# EAGLE design Lighthouse Tracker (EAGLE 9.6.2)
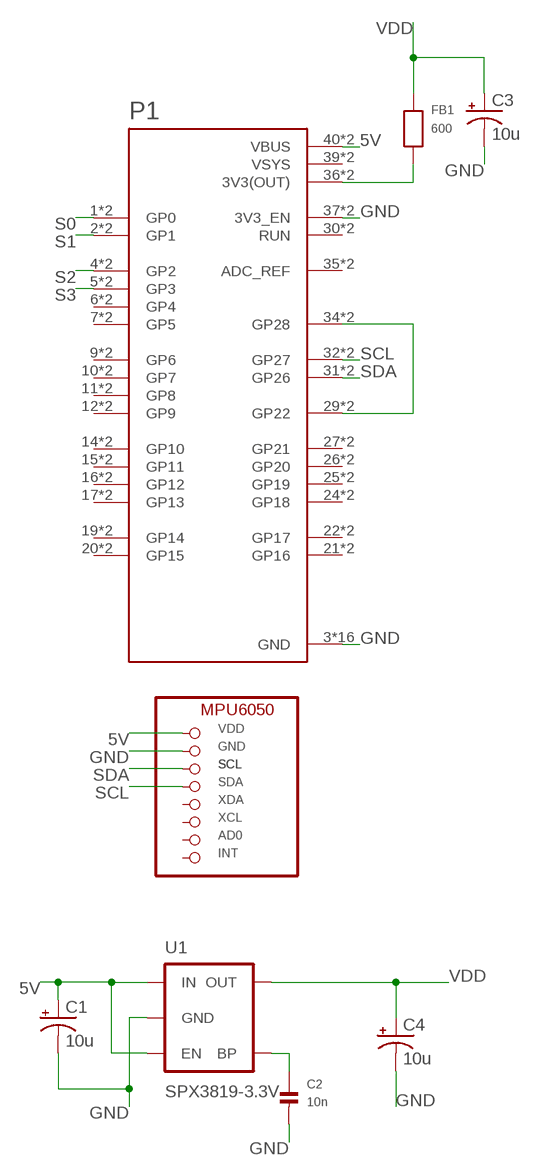
[diagram p0: schematic, sheet 1, part 1 of 2]
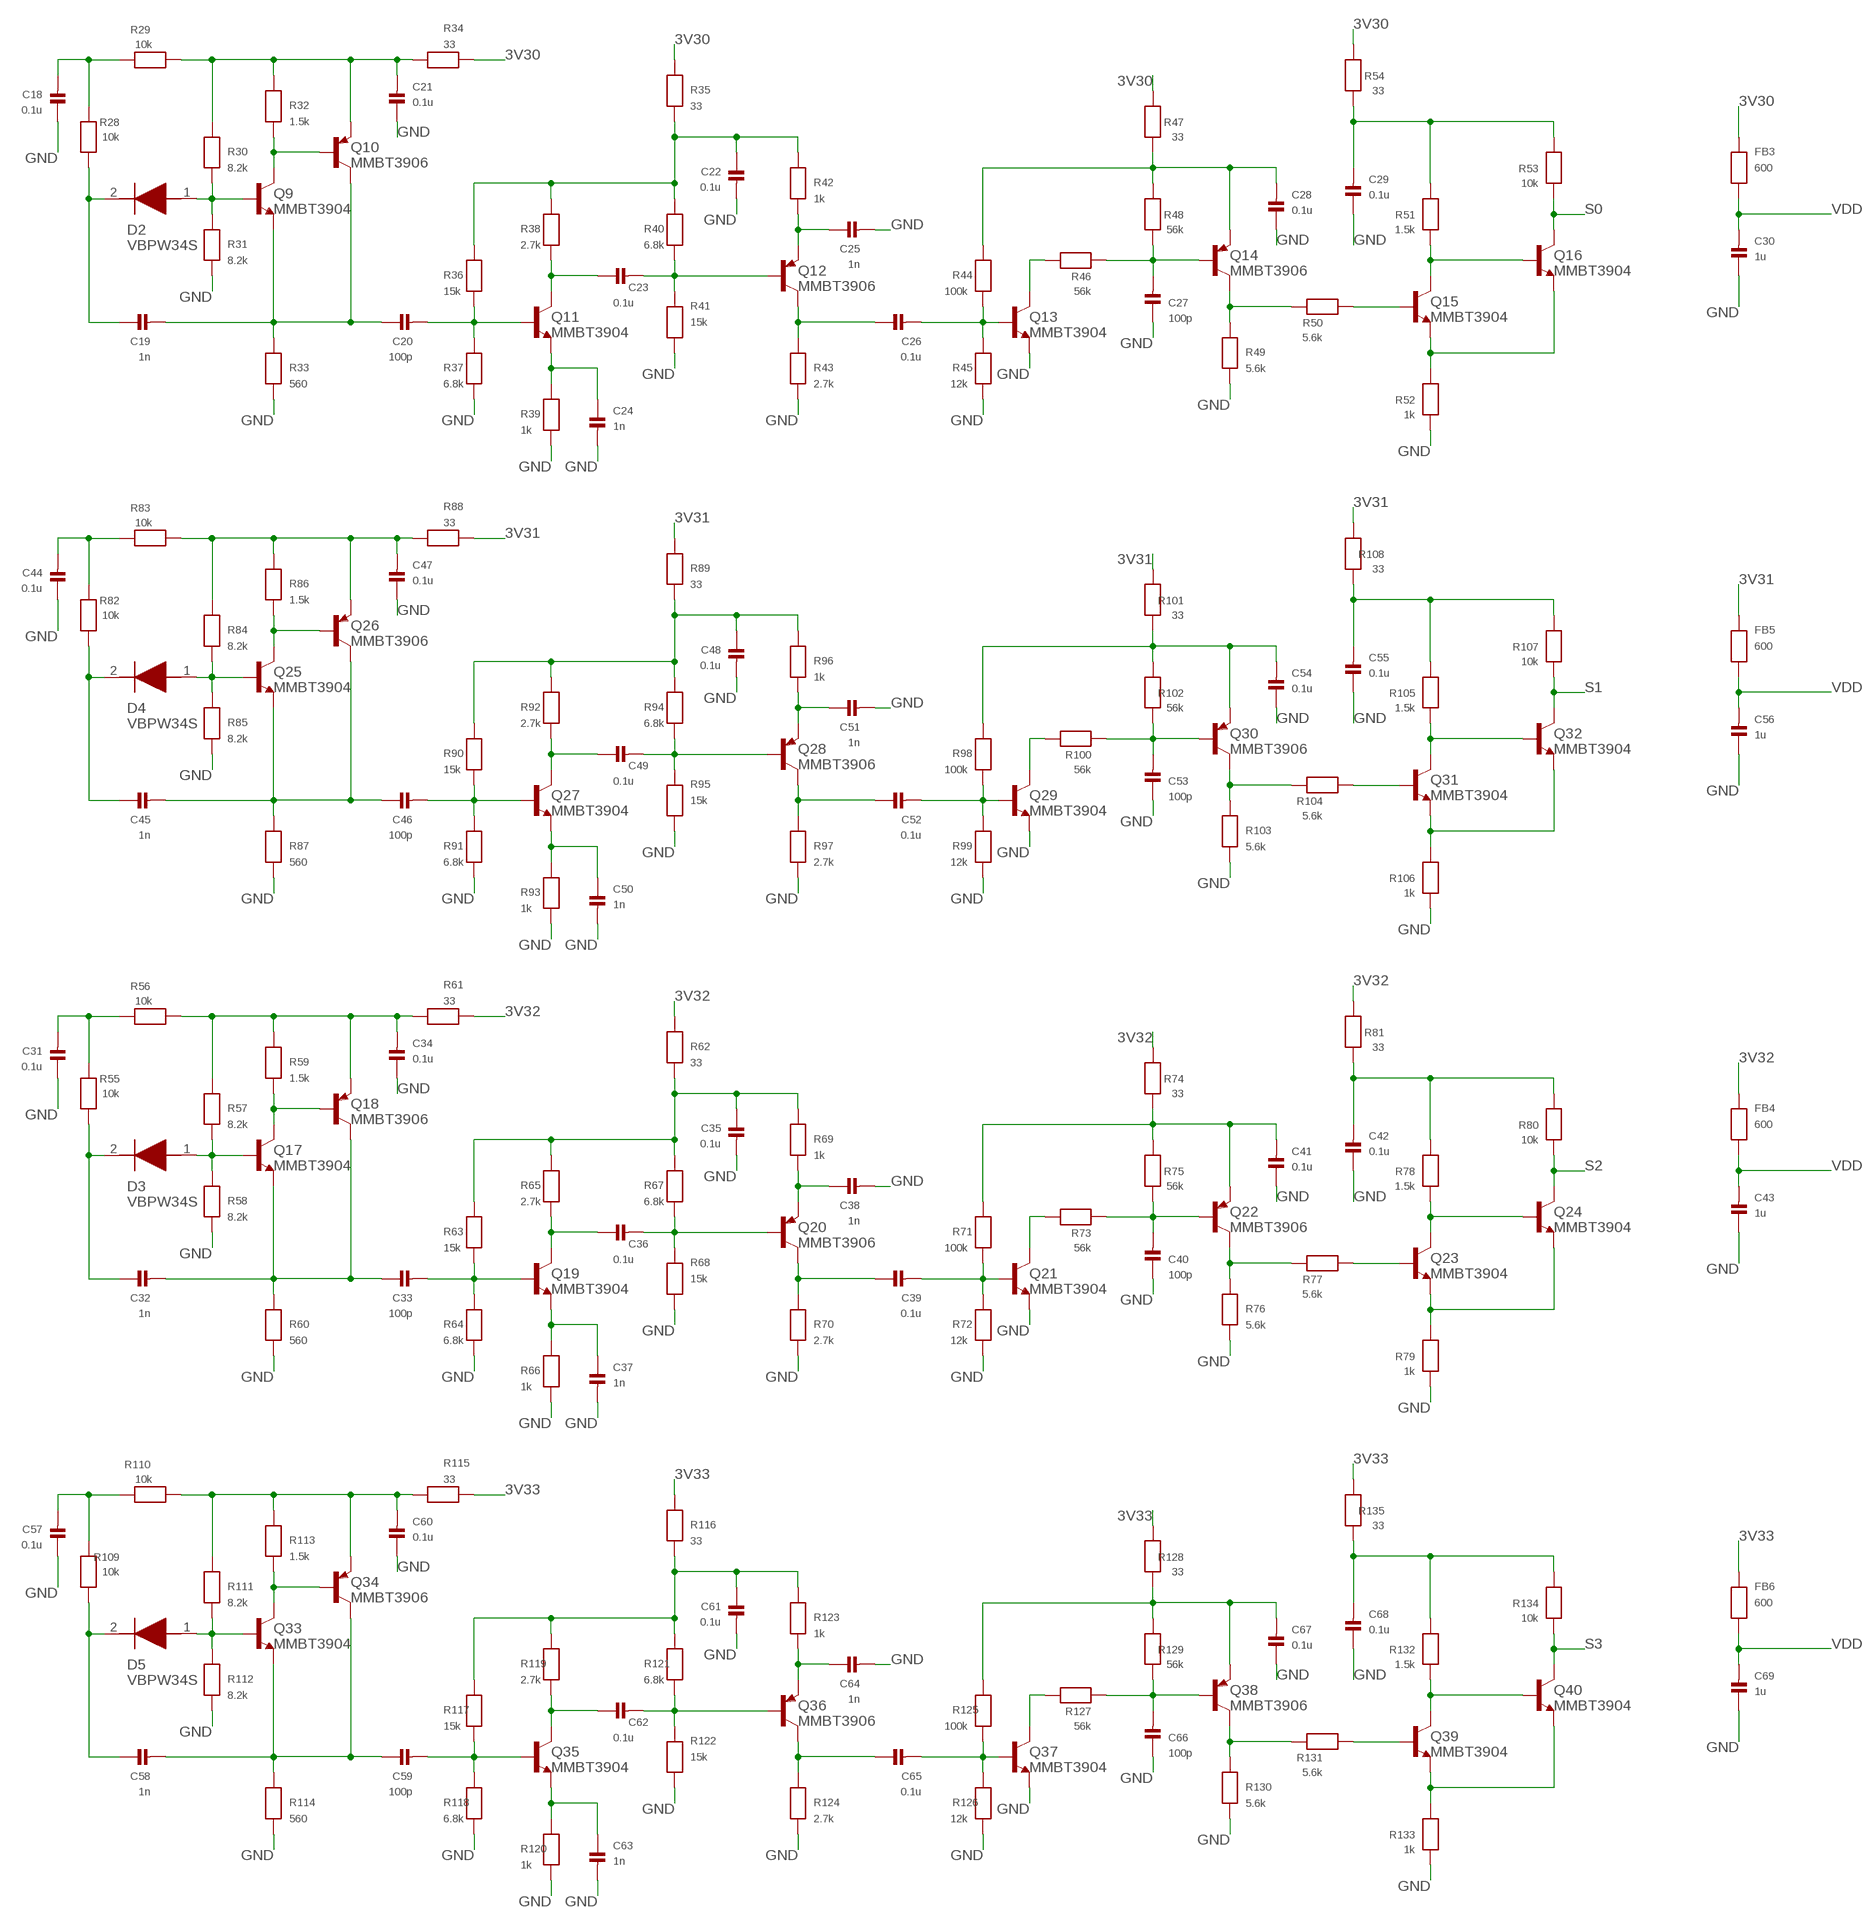
[diagram p1: schematic, sheet 1, part 2 of 2]

## Parts
B1  MPU6050BREAKOUT  [MPU6050]
C1  10u  CPOL-USA/3216-18R  [A/3216-18R]
C2  10n  CAP_CERAMIC0603  [0603]
C3  10u  CPOL-USA/3216-18R  [A/3216-18R]
C4  10u  CPOL-USA/3216-18R  [A/3216-18R]
C18  0.1u  CAP_CERAMIC_C0603  [C0603]
C19  1n  CAP_CERAMIC_C0603  [C0603]
C20  100p  CAP_CERAMIC_C0603  [C0603]
C21  0.1u  CAP_CERAMIC_C0603  [C0603]
C22  0.1u  CAP_CERAMIC_C0603  [C0603]
C23  0.1u  CAP_CERAMIC_C0603  [C0603]
C24  1n  CAP_CERAMIC_C0603  [C0603]
C25  1n  CAP_CERAMIC_C0603  [C0603]
C26  0.1u  CAP_CERAMIC_C0603  [C0603]
C27  100p  CAP_CERAMIC_C0603  [C0603]
C28  0.1u  CAP_CERAMIC_C0603  [C0603]
C29  0.1u  CAP_CERAMIC_C0603  [C0603]
C30  1u  CAP_CERAMIC_C0603  [C0603]
C31  0.1u  CAP_CERAMIC_C0603  [C0603]
C32  1n  CAP_CERAMIC_C0603  [C0603]
C33  100p  CAP_CERAMIC_C0603  [C0603]
C34  0.1u  CAP_CERAMIC_C0603  [C0603]
C35  0.1u  CAP_CERAMIC_C0603  [C0603]
C36  0.1u  CAP_CERAMIC_C0603  [C0603]
C37  1n  CAP_CERAMIC_C0603  [C0603]
C38  1n  CAP_CERAMIC_C0603  [C0603]
C39  0.1u  CAP_CERAMIC_C0603  [C0603]
C40  100p  CAP_CERAMIC_C0603  [C0603]
C41  0.1u  CAP_CERAMIC_C0603  [C0603]
C42  0.1u  CAP_CERAMIC_C0603  [C0603]
C43  1u  CAP_CERAMIC_C0603  [C0603]
C44  0.1u  CAP_CERAMIC_C0603  [C0603]
C45  1n  CAP_CERAMIC_C0603  [C0603]
C46  100p  CAP_CERAMIC_C0603  [C0603]
C47  0.1u  CAP_CERAMIC_C0603  [C0603]
C48  0.1u  CAP_CERAMIC_C0603  [C0603]
C49  0.1u  CAP_CERAMIC_C0603  [C0603]
C50  1n  CAP_CERAMIC_C0603  [C0603]
C51  1n  CAP_CERAMIC_C0603  [C0603]
C52  0.1u  CAP_CERAMIC_C0603  [C0603]
C53  100p  CAP_CERAMIC_C0603  [C0603]
C54  0.1u  CAP_CERAMIC_C0603  [C0603]
C55  0.1u  CAP_CERAMIC_C0603  [C0603]
C56  1u  CAP_CERAMIC_C0603  [C0603]
C57  0.1u  CAP_CERAMIC_C0603  [C0603]
C58  1n  CAP_CERAMIC_C0603  [C0603]
C59  100p  CAP_CERAMIC_C0603  [C0603]
C60  0.1u  CAP_CERAMIC_C0603  [C0603]
C61  0.1u  CAP_CERAMIC_C0603  [C0603]
C62  0.1u  CAP_CERAMIC_C0603  [C0603]
C63  1n  CAP_CERAMIC_C0603  [C0603]
C64  1n  CAP_CERAMIC_C0603  [C0603]
C65  0.1u  CAP_CERAMIC_C0603  [C0603]
C66  100p  CAP_CERAMIC_C0603  [C0603]
C67  0.1u  CAP_CERAMIC_C0603  [C0603]
C68  0.1u  CAP_CERAMIC_C0603  [C0603]
C69  1u  CAP_CERAMIC_C0603  [C0603]
D2  VBPW34S  [VBPW34S]
D3  VBPW34S  [VBPW34S]
D4  VBPW34S  [VBPW34S]
D5  VBPW34S  [VBPW34S]
FB1  600  RESISTOR_R0603  [R0603]
FB3  600  RESISTOR_R0603  [R0603]
FB4  600  RESISTOR_R0603  [R0603]
FB5  600  RESISTOR_R0603  [R0603]
FB6  600  RESISTOR_R0603  [R0603]
P1  RASPBERRY_PICO-NO_DEBUG  [PICO-PKG-NO_DEBUG]
Q9  MMBT3904  BC849SMD  [SOT23-BEC]
Q10  MMBT3906  MMBT3906LT1SMD  [SOT23-BEC]
Q11  MMBT3904  BC849SMD  [SOT23-BEC]
Q12  MMBT3906  MMBT3906LT1SMD  [SOT23-BEC]
Q13  MMBT3904  BC849SMD  [SOT23-BEC]
Q14  MMBT3906  MMBT3906LT1SMD  [SOT23-BEC]
Q15  MMBT3904  BC849SMD  [SOT23-BEC]
Q16  MMBT3904  BC849SMD  [SOT23-BEC]
Q17  MMBT3904  BC849SMD  [SOT23-BEC]
Q18  MMBT3906  MMBT3906LT1SMD  [SOT23-BEC]
Q19  MMBT3904  BC849SMD  [SOT23-BEC]
Q20  MMBT3906  MMBT3906LT1SMD  [SOT23-BEC]
Q21  MMBT3904  BC849SMD  [SOT23-BEC]
Q22  MMBT3906  MMBT3906LT1SMD  [SOT23-BEC]
Q23  MMBT3904  BC849SMD  [SOT23-BEC]
Q24  MMBT3904  BC849SMD  [SOT23-BEC]
Q25  MMBT3904  BC849SMD  [SOT23-BEC]
Q26  MMBT3906  MMBT3906LT1SMD  [SOT23-BEC]
Q27  MMBT3904  BC849SMD  [SOT23-BEC]
Q28  MMBT3906  MMBT3906LT1SMD  [SOT23-BEC]
Q29  MMBT3904  BC849SMD  [SOT23-BEC]
Q30  MMBT3906  MMBT3906LT1SMD  [SOT23-BEC]
Q31  MMBT3904  BC849SMD  [SOT23-BEC]
Q32  MMBT3904  BC849SMD  [SOT23-BEC]
Q33  MMBT3904  BC849SMD  [SOT23-BEC]
Q34  MMBT3906  MMBT3906LT1SMD  [SOT23-BEC]
Q35  MMBT3904  BC849SMD  [SOT23-BEC]
Q36  MMBT3906  MMBT3906LT1SMD  [SOT23-BEC]
Q37  MMBT3904  BC849SMD  [SOT23-BEC]
Q38  MMBT3906  MMBT3906LT1SMD  [SOT23-BEC]
Q39  MMBT3904  BC849SMD  [SOT23-BEC]
Q40  MMBT3904  BC849SMD  [SOT23-BEC]
R28  10k  RESISTOR_R0603  [R0603]
R29  10k  RESISTOR_R0603  [R0603]
R30  8.2k  RESISTOR_R0603  [R0603]
R31  8.2k  RESISTOR_R0603  [R0603]
R32  1.5k  RESISTOR_R0603  [R0603]
R33  560  RESISTOR_R0603  [R0603]
R34  33  RESISTOR_R0603  [R0603]
R35  33  RESISTOR_R0603  [R0603]
R36  15k  RESISTOR_R0603  [R0603]
R37  6.8k  RESISTOR_R0603  [R0603]
R38  2.7k  RESISTOR_R0603  [R0603]
R39  1k  RESISTOR_R0603  [R0603]
R40  6.8k  RESISTOR_R0603  [R0603]
R41  15k  RESISTOR_R0603  [R0603]
R42  1k  RESISTOR_R0603  [R0603]
R43  2.7k  RESISTOR_R0603  [R0603]
R44  100k  RESISTOR_R0603  [R0603]
R45  12k  RESISTOR_R0603  [R0603]
R46  56k  RESISTOR_R0603  [R0603]
R47  33  RESISTOR_R0603  [R0603]
R48  56k  RESISTOR_R0603  [R0603]
R49  5.6k  RESISTOR_R0603  [R0603]
R50  5.6k  RESISTOR_R0603  [R0603]
R51  1.5k  RESISTOR_R0603  [R0603]
R52  1k  RESISTOR_R0603  [R0603]
R53  10k  RESISTOR_R0603  [R0603]
R54  33  RESISTOR_R0603  [R0603]
R55  10k  RESISTOR_R0603  [R0603]
R56  10k  RESISTOR_R0603  [R0603]
R57  8.2k  RESISTOR_R0603  [R0603]
R58  8.2k  RESISTOR_R0603  [R0603]
R59  1.5k  RESISTOR_R0603  [R0603]
R60  560  RESISTOR_R0603  [R0603]
R61  33  RESISTOR_R0603  [R0603]
R62  33  RESISTOR_R0603  [R0603]
R63  15k  RESISTOR_R0603  [R0603]
R64  6.8k  RESISTOR_R0603  [R0603]
R65  2.7k  RESISTOR_R0603  [R0603]
R66  1k  RESISTOR_R0603  [R0603]
R67  6.8k  RESISTOR_R0603  [R0603]
R68  15k  RESISTOR_R0603  [R0603]
R69  1k  RESISTOR_R0603  [R0603]
R70  2.7k  RESISTOR_R0603  [R0603]
R71  100k  RESISTOR_R0603  [R0603]
R72  12k  RESISTOR_R0603  [R0603]
R73  56k  RESISTOR_R0603  [R0603]
R74  33  RESISTOR_R0603  [R0603]
R75  56k  RESISTOR_R0603  [R0603]
R76  5.6k  RESISTOR_R0603  [R0603]
R77  5.6k  RESISTOR_R0603  [R0603]
R78  1.5k  RESISTOR_R0603  [R0603]
R79  1k  RESISTOR_R0603  [R0603]
R80  10k  RESISTOR_R0603  [R0603]
R81  33  RESISTOR_R0603  [R0603]
R82  10k  RESISTOR_R0603  [R0603]
R83  10k  RESISTOR_R0603  [R0603]
R84  8.2k  RESISTOR_R0603  [R0603]
R85  8.2k  RESISTOR_R0603  [R0603]
R86  1.5k  RESISTOR_R0603  [R0603]
R87  560  RESISTOR_R0603  [R0603]
R88  33  RESISTOR_R0603  [R0603]
R89  33  RESISTOR_R0603  [R0603]
R90  15k  RESISTOR_R0603  [R0603]
R91  6.8k  RESISTOR_R0603  [R0603]
R92  2.7k  RESISTOR_R0603  [R0603]
R93  1k  RESISTOR_R0603  [R0603]
R94  6.8k  RESISTOR_R0603  [R0603]
R95  15k  RESISTOR_R0603  [R0603]
R96  1k  RESISTOR_R0603  [R0603]
R97  2.7k  RESISTOR_R0603  [R0603]
R98  100k  RESISTOR_R0603  [R0603]
R99  12k  RESISTOR_R0603  [R0603]
R100  56k  RESISTOR_R0603  [R0603]
R101  33  RESISTOR_R0603  [R0603]
R102  56k  RESISTOR_R0603  [R0603]
R103  5.6k  RESISTOR_R0603  [R0603]
R104  5.6k  RESISTOR_R0603  [R0603]
R105  1.5k  RESISTOR_R0603  [R0603]
R106  1k  RESISTOR_R0603  [R0603]
R107  10k  RESISTOR_R0603  [R0603]
R108  33  RESISTOR_R0603  [R0603]
R109  10k  RESISTOR_R0603  [R0603]
R110  10k  RESISTOR_R0603  [R0603]
R111  8.2k  RESISTOR_R0603  [R0603]
R112  8.2k  RESISTOR_R0603  [R0603]
R113  1.5k  RESISTOR_R0603  [R0603]
R114  560  RESISTOR_R0603  [R0603]
R115  33  RESISTOR_R0603  [R0603]
R116  33  RESISTOR_R0603  [R0603]
R117  15k  RESISTOR_R0603  [R0603]
R118  6.8k  RESISTOR_R0603  [R0603]
R119  2.7k  RESISTOR_R0603  [R0603]
R120  1k  RESISTOR_R0603  [R0603]
R121  6.8k  RESISTOR_R0603  [R0603]
R122  15k  RESISTOR_R0603  [R0603]
R123  1k  RESISTOR_R0603  [R0603]
R124  2.7k  RESISTOR_R0603  [R0603]
R125  100k  RESISTOR_R0603  [R0603]
R126  12k  RESISTOR_R0603  [R0603]
R127  56k  RESISTOR_R0603  [R0603]
R128  33  RESISTOR_R0603  [R0603]
R129  56k  RESISTOR_R0603  [R0603]
R130  5.6k  RESISTOR_R0603  [R0603]
R131  5.6k  RESISTOR_R0603  [R0603]
R132  1.5k  RESISTOR_R0603  [R0603]
R133  1k  RESISTOR_R0603  [R0603]
R134  10k  RESISTOR_R0603  [R0603]
R135  33  RESISTOR_R0603  [R0603]
U1  SPX3819-3.3V  V_REG_LDOSMD  [SOT23-5]

## Nets
3V30 [POWER]: FB3.2 R34.2 R35.1 R47.2 R54.2
3V31 [POWER]: FB5.2 R88.2 R89.1 R101.2 R108.2
3V32 [POWER]: FB4.2 R61.2 R62.1 R74.2 R81.2
3V33 [POWER]: FB6.2 R115.2 R116.1 R128.2 R135.2
5V [POWER]: B1.VDD C1.+ P1.40(VBUS) P1.P$40(VBUS) U1.1(IN) U1.3(EN)
GND: B1.GND C1.- C2.2 C3.- C4.- C18.1 C21.1 C22.2 C24.2 C25.2 C27.1 C28.1 C29.1 C30.1 C31.1 C34.1 C35.2 C37.2 C38.2 C40.1 C41.1 C42.1 C43.1 C44.1 C47.1 C48.2 C50.2 C51.2 C53.1 C54.1 C55.1 C56.1 C57.1 C60.1 C61.2 C63.2 C64.2 C66.1 C67.1 C68.1 C69.1 P1.3(GND) P1.8(GND) P1.13(GND) P1.18(GND) P1.23(GND) P1.28(GND) P1.33(GND) P1.37(3V3_EN) P1.38(GND) P1.P$3(GND) P1.P$8(GND) P1.P$13(GND) P1.P$18(GND) P1.P$23(GND) P1.P$28(GND) P1.P$33(GND) P1.P$37(3V3_EN) P1.P$38(GND) Q13.E Q21.E Q29.E Q37.E R31.2 R33.2 R37.2 R39.2 R41.2 R43.2 R45.2 R49.1 R52.2 R58.2 R60.2 R64.2 R66.2 R68.2 R70.2 R72.2 R76.1 R79.2 R85.2 R87.2 R91.2 R93.2 R95.2 R97.2 R99.2 R103.1 R106.2 R112.2 R114.2 R118.2 R120.2 R122.2 R124.2 R126.2 R130.1 R133.2 U1.2(GND)
N$1: C2.1 U1.4(BP)
N$2: FB1.1 P1.36(3V3(OUT)) P1.P$36(3V3(OUT))
N$23: P1.29(GP22) P1.34(GP28) P1.P$29(GP22) P1.P$34(GP28)
N$27: C18.2 R28.2 R29.2
N$28: C19.1 D2.2(K) R28.1
N$29: D2.1(A) Q9.B R30.2 R31.1
N$30: C21.2 Q10.E R29.1 R30.1 R32.1 R34.1
N$31: Q9.C Q10.B R32.2
N$32: C19.2 C20.1 Q9.E Q10.C R33.1
N$33: C22.1 R35.2 R36.1 R38.1 R40.1 R42.1
N$34: C20.2 Q11.B R36.2 R37.1
N$35: C23.1 Q11.C R38.2
N$36: C24.1 Q11.E R39.1
N$37: C23.2 Q12.B R40.2 R41.1
N$38: C25.1 Q12.E R42.2
N$39: C26.1 Q12.C R43.1
N$40: C26.2 Q13.B R44.2 R45.1
N$41: C28.2 Q14.E R44.1 R47.1 R48.2
N$42: C27.2 Q14.B R46.2 R48.1
N$43: Q13.C R46.1
N$44: Q14.C R49.2 R50.2
N$45: Q15.B R50.1
N$46: Q15.E Q16.E R52.1
N$47: Q15.C Q16.B R51.2
N$48: C29.2 R51.1 R53.1 R54.1
N$50: C31.2 R55.2 R56.2
N$51: C32.1 D3.2(K) R55.1
N$52: D3.1(A) Q17.B R57.2 R58.1
N$53: C34.2 Q18.E R56.1 R57.1 R59.1 R61.1
N$54: Q17.C Q18.B R59.2
N$55: C32.2 C33.1 Q17.E Q18.C R60.1
N$56: C35.1 R62.2 R63.1 R65.1 R67.1 R69.1
N$57: C33.2 Q19.B R63.2 R64.1
N$58: C36.1 Q19.C R65.2
N$59: C37.1 Q19.E R66.1
N$60: C36.2 Q20.B R67.2 R68.1
N$61: C38.1 Q20.E R69.2
N$62: C39.1 Q20.C R70.1
N$63: C39.2 Q21.B R71.2 R72.1
N$64: C41.2 Q22.E R71.1 R74.1 R75.2
N$65: C40.2 Q22.B R73.2 R75.1
N$66: Q21.C R73.1
N$67: Q22.C R76.2 R77.2
N$68: Q23.B R77.1
N$69: Q23.E Q24.E R79.1
N$70: Q23.C Q24.B R78.2
N$71: C42.2 R78.1 R80.1 R81.1
N$73: C44.2 R82.2 R83.2
N$74: C45.1 D4.2(K) R82.1
N$75: D4.1(A) Q25.B R84.2 R85.1
N$76: C47.2 Q26.E R83.1 R84.1 R86.1 R88.1
N$77: Q25.C Q26.B R86.2
N$78: C45.2 C46.1 Q25.E Q26.C R87.1
N$79: C48.1 R89.2 R90.1 R92.1 R94.1 R96.1
N$80: C46.2 Q27.B R90.2 R91.1
N$81: C49.1 Q27.C R92.2
N$82: C50.1 Q27.E R93.1
N$83: C49.2 Q28.B R94.2 R95.1
N$84: C51.1 Q28.E R96.2
N$85: C52.1 Q28.C R97.1
N$86: C52.2 Q29.B R98.2 R99.1
N$87: C54.2 Q30.E R98.1 R101.1 R102.2
N$88: C53.2 Q30.B R100.2 R102.1
N$89: Q29.C R100.1
N$90: Q30.C R103.2 R104.2
N$91: Q31.B R104.1
N$92: Q31.E Q32.E R106.1
N$93: Q31.C Q32.B R105.2
N$94: C55.2 R105.1 R107.1 R108.1
N$96: C57.2 R109.2 R110.2
N$97: C58.1 D5.2(K) R109.1
N$98: D5.1(A) Q33.B R111.2 R112.1
N$99: C60.2 Q34.E R110.1 R111.1 R113.1 R115.1
N$100: Q33.C Q34.B R113.2
N$101: C58.2 C59.1 Q33.E Q34.C R114.1
N$102: C61.1 R116.2 R117.1 R119.1 R121.1 R123.1
N$103: C59.2 Q35.B R117.2 R118.1
N$104: C62.1 Q35.C R119.2
N$105: C63.1 Q35.E R120.1
N$106: C62.2 Q36.B R121.2 R122.1
N$107: C64.1 Q36.E R123.2
N$108: C65.1 Q36.C R124.1
N$109: C65.2 Q37.B R125.2 R126.1
N$110: C67.2 Q38.E R125.1 R128.1 R129.2
N$111: C66.2 Q38.B R127.2 R129.1
N$112: Q37.C R127.1
N$113: Q38.C R130.2 R131.2
N$114: Q39.B R131.1
N$115: Q39.E Q40.E R133.1
N$116: Q39.C Q40.B R132.2
N$117: C68.2 R132.1 R134.1 R135.1
S0: P1.1(GP0) P1.P$1(GP0) Q16.C R53.2
S1: P1.2(GP1) P1.P$2(GP1) Q32.C R107.2
S2: P1.4(GP2) P1.P$4(GP2) Q24.C R80.2
S3: P1.5(GP3) P1.P$5(GP3) Q40.C R134.2
SCL: B1.SDA P1.32(GP27) P1.P$32(GP27)
SDA: B1.SCL P1.31(GP26) P1.P$31(GP26)
VDD: C3.+ C4.+ C30.2 C43.2 C56.2 C69.2 FB1.2 FB3.1 FB4.1 FB5.1 FB6.1 U1.5(OUT)
Unconnected: B1.AD0 B1.INT B1.XCL B1.XDA P1.6(GP4) P1.7(GP5) P1.9(GP6) P1.10(GP7) P1.11(GP8) P1.12(GP9) P1.14(GP10) P1.15(GP11) P1.16(GP12) P1.17(GP13) P1.19(GP14) P1.20(GP15) P1.21(GP16) P1.22(GP17) P1.24(GP18) P1.25(GP19) P1.26(GP20) P1.27(GP21) P1.30(RUN) P1.35(ADC_REF) P1.P$6(GP4) P1.P$7(GP5) P1.P$9(GP6) P1.P$10(GP7) P1.P$11(GP8) P1.P$12(GP9) P1.P$14(GP10) P1.P$15(GP11) P1.P$16(GP12) P1.P$17(GP13) P1.P$19(GP14) P1.P$20(GP15) P1.P$21(GP16) P1.P$22(GP17) P1.P$24(GP18) P1.P$25(GP19) P1.P$26(GP20) P1.P$27(GP21) P1.P$30(RUN) P1.P$35(ADC_REF)

## Power pins joined to a net without a drawn wire
VSYS: P1.39(VSYS) P1.P$39(VSYS)

## Library data of the parts
B1 = breakoutbrds:MPU6050BREAKOUT
C1 C3 C4 = Anran_adafruit:CPOL-US: POLARIZED CAPACITOR, American symbol
C2 C18-C69 = Anran_microbuilder:CAP_CERAMIC: Ceramic Capacitors 0402 - 0402 Surface Mount Capacitors 0603 - 0603 Surface Mount Capacitors 0805 - 0805 Surface Mount Capacitors 1206 - 1206 Surface Mount Capacitors
D2-D5 = VBPW34S:VBPW34S: Photodiode PIN Chip 940nm 2-Pin SMD T/R Source: Datasheet <https://componentsearchengine.com/Datasheets/2/VBPW34S.pdf>; ARROW_PART_NUMBER: VBPW34S; ARROW_PRICE-STOCK: https://www.arrow.com/en/products/vbpw34s/vishay?region=nac; DESCRIPTION: Photodiode PIN Chip 940nm 2-Pin SMD T/R; HEIGHT: 1.3mm; MANUFACTURER_NAME: Vishay; MANUFACTURER_PART_NUMBER: VBPW34S; MOUSER_PART_NUMBER: 782-VBPW34S; MOUSER_PRICE-STOCK: https://www.mouser.co.uk/ProductDetail/Vishay-Semiconductors/VBPW34S?qs=Uj7aA%252BCqp8ZDwjFKEZ8K8A%3D%3D
FB1 FB3-FB6 R28-R135 = Anran_microbuilder:RESISTOR: Resistors 0402 - 0402 Surface Mount Package 0603 - 0603 Surface Mount Package 0805 - 0805 Surface Mount Package 1206 - 1206 Surface Mount Package 2012 - 2010 Surface Mount Package
P1 = RpiPico:RASPBERRY_PICO-NO_DEBUG
Q9 Q11 Q13 Q15-Q17 Q19 Q21 Q23-Q25 Q27 Q29 Q31-Q33 Q35 Q37 Q39 Q40 = transistor-npn:BC849*: NPN Transistor
Q10 Q12 Q14 Q18 Q20 Q22 Q26 Q28 Q30 Q34 Q36 Q38 = transistor-pnp:MMBT3906*: PNP Transistror
U1 = SparkFun:V_REG_LDO: Voltage Regulator LDO Standard 150mA LDO voltage regulator in SOT-23 layout. Micrel part MIC5205. BP (by-pass) pin is used to lower output noise with 470pF cap.

## Net classes
0 default: width 0.152 mm, drill 0.3 mm, clearance 0.152 mm
1 POWER: width 0.152 mm, drill 0.3 mm, clearance 0.152 mm

## Board
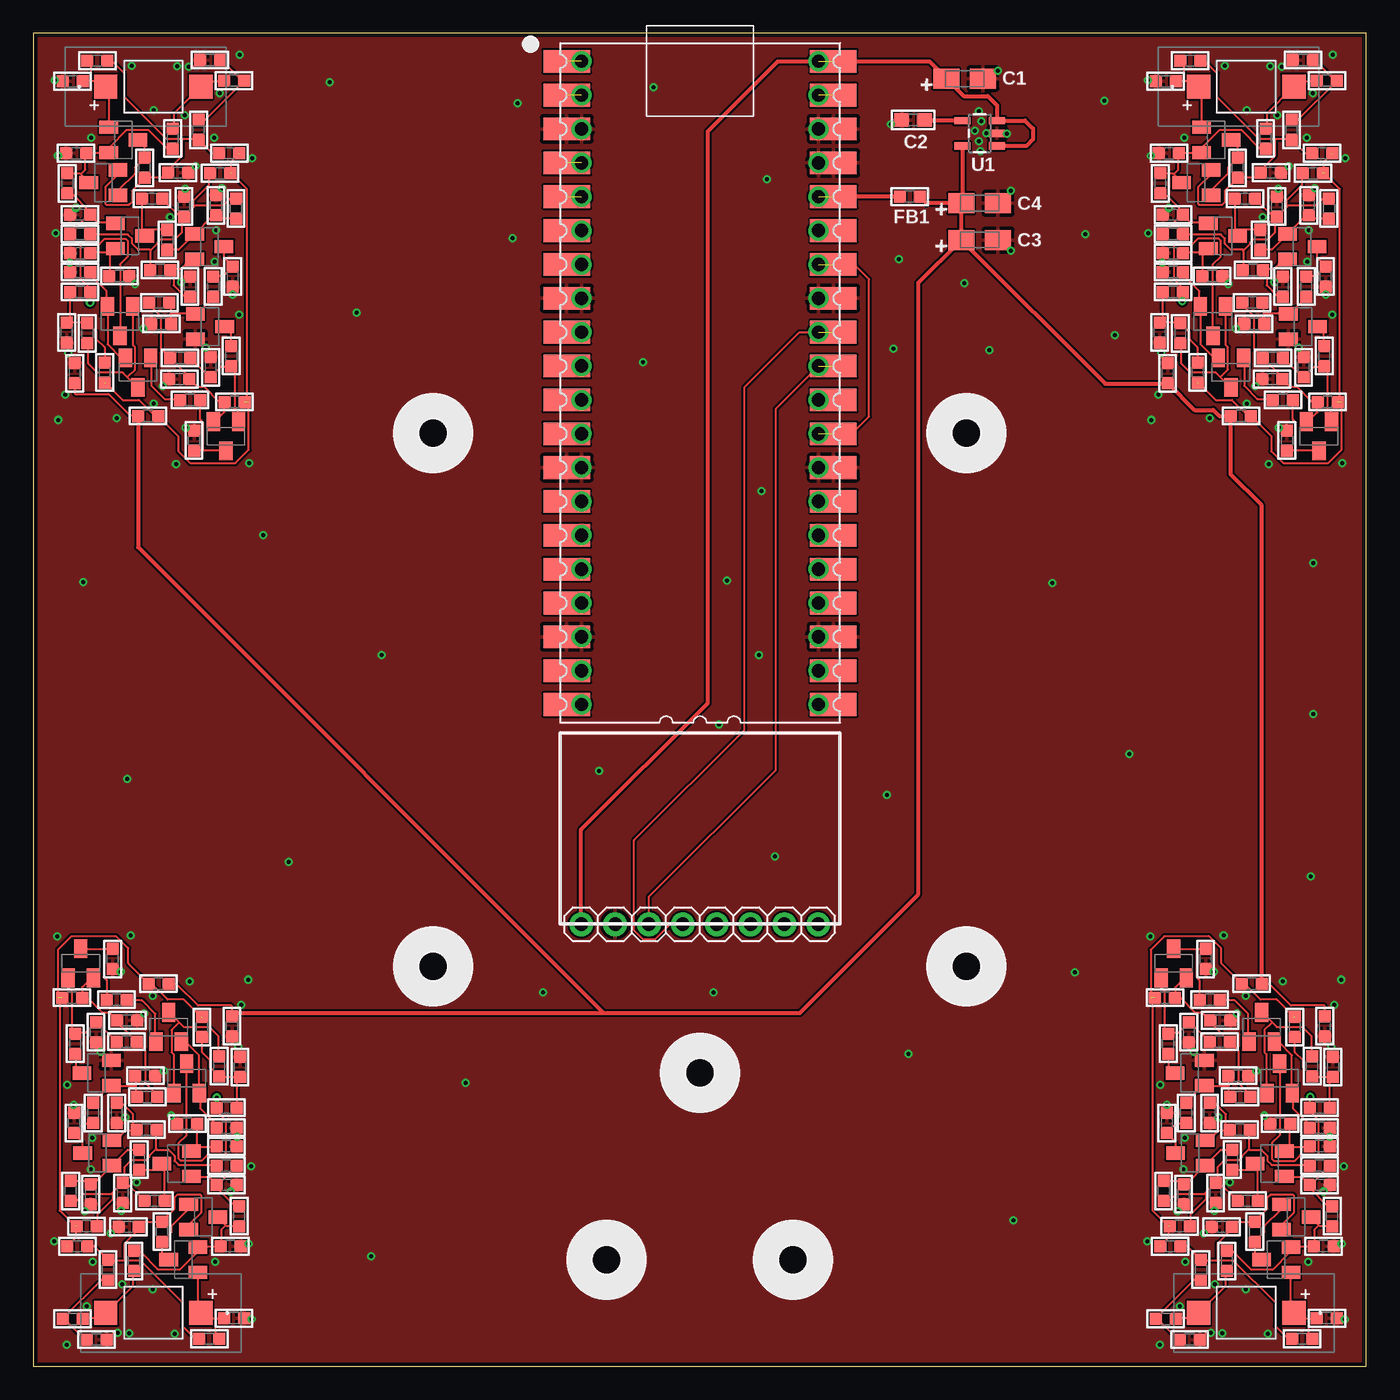
[diagram p2: board, top side]
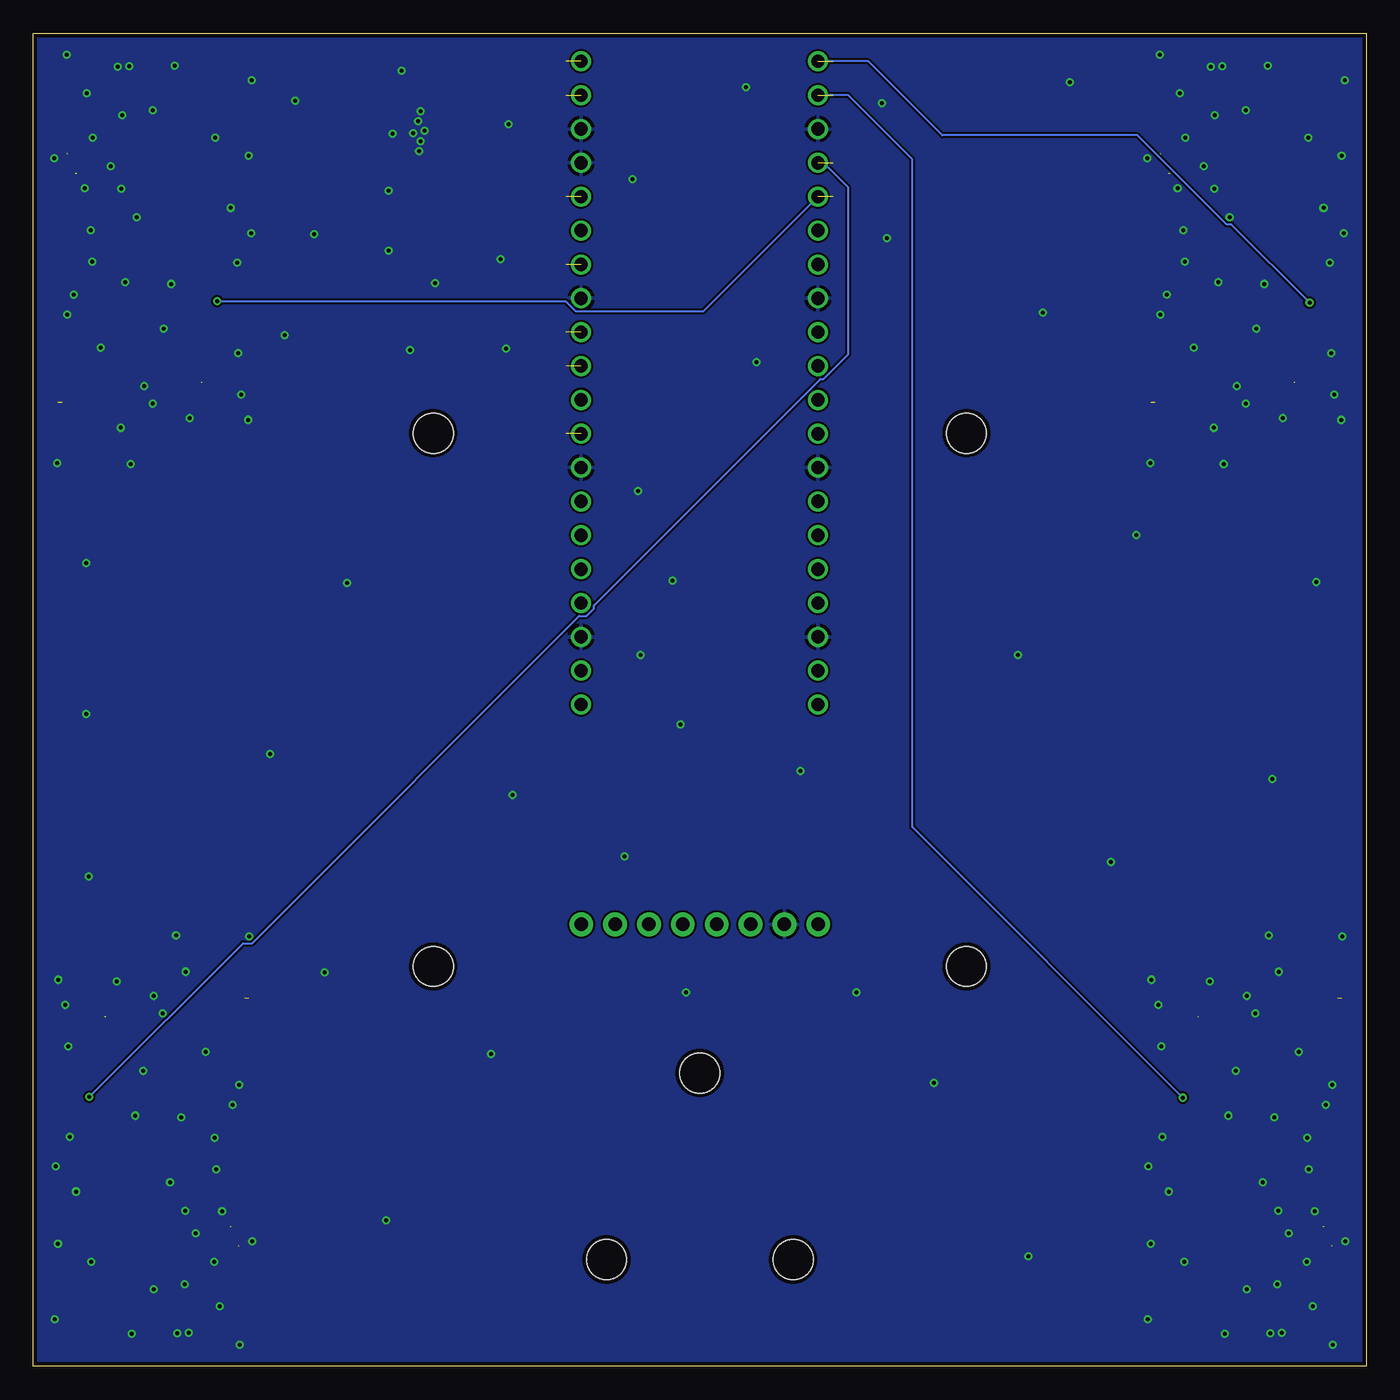
[diagram p3: board, bottom side, seen from below]

Size 100 x 100 mm. Coordinates in mm from the lower left corner, seen from the top.
Outline: 0,0 100,0 100,100 0,100 0,0
Copper layers (1*16): Top 0.035mm / dielectric 1.53mm / Bottom 0.035mm
Design rules "standard2layer": minimum track width 6mil, minimum drill 0.3mm, track to track 6mil, track to pad 6mil, pad to pad 6mil, via to via 6mil, smd to smd 0mil, copper to edge 12mil, drill to drill 12mil, minimum pad ring 6mil, minimum via ring 6mil, stop-mask expansion 4mil, vias tented up to drill 0.3mm, thermal gap 10mil
Holes 3 mm at 30,30 70,30 30,70 70,70 50,22 43,8 57,8

### Footprints (pad centres in the part's own frame; a part is rotated, then mirrored left to right if it is on the bottom)
MPU6050 = drill 1.016 pad 1.778: AD0 -6.35,6.85; GND 6.35,6.85; INT -8.89,6.85; SCL 3.81,6.85; SDA 1.27,6.85; VDD 8.89,6.85; XCL -3.81,6.85; XDA -1.27,6.85
A/3216-18R = smd 1.95 x 1.5: + 1.375,0; - -1.375,0
0603 = smd 1.1 x 1: 1 -0.85,0; 2 0.85,0
C0603 = smd 0.9 x 0.9: 1 -0.75,0; 2 0.75,0
VBPW34S = smd 1.75 x 1.8: 1 -3.575,0; 2 3.575,0
R0603 = smd 0.9 x 0.9: 1 -0.75,0; 2 0.75,0
PICO-PKG-NO_DEBUG = drill 1: 1 -7.62,25.4; 2 -7.62,22.86; 3 -7.62,20.32; 4 -7.62,17.78; 5 -7.62,15.24; 6 -7.62,12.7; 7 -7.62,10.16; 8 -7.62,7.62; 9 -7.62,5.08; 10 -7.62,2.54; 11 -7.62,0; 12 -7.62,-2.54; 13 -7.62,-5.08; 14 -7.62,-7.62; 15 -7.62,-10.16; 16 -7.62,-12.7; 17 -7.62,-15.24; 18 -7.62,-17.78; 19 -7.62,-20.32; 20 -7.62,-22.86; 21 10.16,-22.86; 22 10.16,-20.32; 23 10.16,-17.78; 24 10.16,-15.24; 25 10.16,-12.7; 26 10.16,-10.16; 27 10.16,-7.62; 28 10.16,-5.08; 29 10.16,-2.54; 30 10.16,0; 31 10.16,2.54; 32 10.16,5.08; 33 10.16,7.62; 34 10.16,10.16; 35 10.16,12.7; 36 10.16,15.24; 37 10.16,17.78; 38 10.16,20.32; 39 10.16,22.86; 40 10.16,25.4 | smd 3.5 x 1.7: P$1 -8.73,25.4; P$2 -8.73,22.86; P$3 -8.73,20.32; P$4 -8.73,17.78; P$5 -8.73,15.24; P$6 -8.73,12.7; P$7 -8.73,10.16; P$8 -8.73,7.62; P$9 -8.73,5.08; P$10 -8.73,2.54; P$11 -8.73,0; P$12 -8.73,-2.54; P$13 -8.73,-5.08; P$14 -8.73,-7.62; P$15 -8.73,-10.16; P$16 -8.73,-12.7; P$17 -8.73,-15.24; P$18 -8.73,-17.78; P$19 -8.73,-20.32; P$20 -8.73,-22.86; P$21 11.27,-22.86; P$22 11.27,-20.32; P$23 11.27,-17.78; P$24 11.27,-15.24; P$25 11.27,-12.7; P$26 11.27,-10.16; P$27 11.27,-7.62; P$28 11.27,-5.08; P$29 11.27,-2.54; P$30 11.27,0; P$31 11.27,2.54; P$32 11.27,5.08; P$33 11.27,7.62; P$34 11.27,10.16; P$35 11.27,12.7; P$36 11.27,15.24; P$37 11.27,17.78; P$38 11.27,20.32; P$39 11.27,22.86; P$40 11.27,25.4
SOT23-BEC = smd 1 x 1.4: B -0.95,-1.1; C 0,1.1; E 0.95,-1.1
SOT23-5 = smd 0.55 x 1.2: 1 -0.95,-1.3; 2 0,-1.3; 3 0.95,-1.3; 4 0.95,1.3; 5 -0.95,1.3

### Placement (x,y rotation side)
B1  50,40 180 top
C1  69.88,96.61 180 top
C2  66,93.5 180 top
C3  71,84.5 180 top
C4  71,87.25 180 top
C18  13.25,98 0 top
C19  10.45,92.1 270 top
C20  2.55,88.75 270 top
C21  10.85,89.55 180 top
C22  11.3,87 90 top
C23  10.05,84.5 270 top
C24  3.5,83.5 180 top
C25  11.75,81 90 top
C26  13.5,81 270 top
C27  13.3,74.95 270 top
C28  10.95,74.05 0 top
C29  2.5,77.55 90 top
C30  3.1,74.5 270 top
C31  86.75,2 180 top
C32  89.55,7.9 90 top
C33  97.45,11.25 90 top
C34  89.15,10.45 0 top
C35  88.7,13 270 top
C36  89.95,15.5 90 top
C37  96.5,16.5 0 top
C38  88.25,19 270 top
C39  86.5,19 90 top
C40  86.7,25.05 90 top
C41  89.05,25.95 180 top
C42  97.5,22.45 270 top
C43  96.9,25.5 90 top
C44  4.75,2 180 top
C45  7.55,7.9 90 top
C46  15.45,11.25 90 top
C47  7.15,10.45 0 top
C48  6.7,13 270 top
C49  7.95,15.5 90 top
C50  14.5,16.5 0 top
C51  6.25,19 270 top
C52  4.5,19 90 top
C53  4.7,25.05 90 top
C54  7.05,25.95 180 top
C55  15.5,22.45 270 top
C56  14.9,25.5 90 top
C57  95.25,98 0 top
C58  92.45,92.1 270 top
C59  84.55,88.75 270 top
C60  92.85,89.55 180 top
C61  93.3,87 90 top
C62  92.05,84.5 270 top
C63  85.5,83.5 180 top
C64  93.75,81 90 top
C65  95.5,81 270 top
C66  95.3,74.95 270 top
C67  92.95,74.05 0 top
C68  84.5,77.55 90 top
C69  85.1,74.5 270 top
D2  9,96 0 top
D3  91,4 180 top
D4  9,4 180 top
D5  91,96 0 top
FB1  65.75,87.75 0 top
FB3  8.6,71.3 0 top
FB4  91.4,28.7 180 top
FB5  9.4,28.7 180 top
FB6  90.6,71.3 0 top
P1  48.75,72.5 0 top
Q9  6.75,92 270 top
Q10  5.25,88.8 90 top
Q11  7.25,84.8 270 top
Q12  13.2,84 270 top
Q13  13.25,78 270 top
Q14  14.45,69.77 180 top
Q15  7.85,74.55 180 top
Q16  6.5,78.4 180 top
Q17  93.25,8 90 top
Q18  94.75,11.2 270 top
Q19  92.75,15.2 90 top
Q20  86.8,16 90 top
Q21  86.75,22 90 top
Q22  85.55,30.23 0 top
Q23  92.15,25.45 0 top
Q24  93.5,21.6 0 top
Q25  11.25,8 90 top
Q26  12.75,11.2 270 top
Q27  10.75,15.2 90 top
Q28  4.8,16 90 top
Q29  4.75,22 90 top
Q30  3.55,30.23 0 top
Q31  10.15,25.45 0 top
Q32  11.5,21.6 0 top
Q33  88.75,92 270 top
Q34  87.25,88.8 90 top
Q35  89.25,84.8 270 top
Q36  95.2,84 270 top
Q37  95.25,78 270 top
Q38  96.45,69.77 180 top
Q39  89.85,74.55 180 top
Q40  88.5,78.4 180 top
R28  15.05,96.45 0 top
R29  12.4,92.75 90 top
R30  4.8,97.95 180 top
R31  2.95,96.4 180 top
R32  8.35,89.9 90 top
R33  3.2,91 180 top
R34  14.7,91 0 top
R35  14,89.5 180 top
R36  3.5,84.95 180 top
R37  3.5,86.4 180 top
R38  8.9,87.6 180 top
R39  6.45,81.8 0 top
R40  15.2,86.85 270 top
R41  13.7,87.1 90 top
R42  9.5,82.25 0 top
R43  14.95,81.75 270 top
R44  9.45,79.8 0 top
R45  9.6,78.2 180 top
R46  14.85,75.8 270 top
R47  15.1,72.35 0 top
R48  11,75.65 180 top
R49  12.05,69.45 270 top
R50  11.75,72.5 0 top
R51  4.05,77.5 270 top
R52  3.5,82.1 180 top
R53  3.5,80.6 0 top
R54  5.35,74.55 270 top
R55  84.95,3.55 180 top
R56  87.6,7.25 270 top
R57  95.2,2.05 0 top
R58  97.05,3.6 0 top
R59  91.65,10.1 270 top
R60  96.8,9 0 top
R61  85.3,9 180 top
R62  86,10.5 0 top
R63  96.5,15.05 0 top
R64  96.5,13.6 0 top
R65  91.1,12.4 0 top
R66  93.55,18.2 180 top
R67  84.8,13.15 90 top
R68  86.3,12.9 270 top
R69  90.5,17.75 180 top
R70  85.05,18.25 90 top
R71  90.55,20.2 180 top
R72  90.4,21.8 0 top
R73  85.15,24.2 90 top
R74  84.9,27.65 180 top
R75  89,24.35 0 top
R76  87.95,30.55 90 top
R77  88.25,27.5 180 top
R78  95.95,22.5 90 top
R79  96.5,17.9 0 top
R80  96.5,19.4 180 top
R81  94.65,25.45 90 top
R82  2.95,3.55 180 top
R83  5.6,7.25 270 top
R84  13.2,2.05 0 top
R85  15.05,3.6 0 top
R86  9.65,10.1 270 top
R87  14.8,9 0 top
R88  3.3,9 180 top
R89  4,10.5 0 top
R90  14.5,15.05 0 top
R91  14.5,13.6 0 top
R92  9.1,12.4 0 top
R93  11.55,18.2 180 top
R94  2.8,13.15 90 top
R95  4.3,12.9 270 top
R96  8.5,17.75 180 top
R97  3.05,18.25 90 top
R98  8.55,20.2 180 top
R99  8.4,21.8 0 top
R100  3.15,24.2 90 top
R101  2.9,27.65 180 top
R102  7,24.35 0 top
R103  5.95,30.55 90 top
R104  6.25,27.5 180 top
R105  13.95,22.5 90 top
R106  14.5,17.9 0 top
R107  14.5,19.4 180 top
R108  12.65,25.45 90 top
R109  97.05,96.45 0 top
R110  94.4,92.75 90 top
R111  86.8,97.95 180 top
R112  84.95,96.4 180 top
R113  90.35,89.9 90 top
R114  85.2,91 180 top
R115  96.7,91 0 top
R116  96,89.5 180 top
R117  85.5,84.95 180 top
R118  85.5,86.4 180 top
R119  90.9,87.6 180 top
R120  88.45,81.8 0 top
R121  97.2,86.85 270 top
R122  95.7,87.1 90 top
R123  91.5,82.25 0 top
R124  96.95,81.75 270 top
R125  91.45,79.8 0 top
R126  91.6,78.2 180 top
R127  96.85,75.8 270 top
R128  97.1,72.35 0 top
R129  93,75.65 180 top
R130  94.05,69.45 270 top
R131  93.75,72.5 0 top
R132  86.05,77.5 270 top
R133  85.5,82.1 180 top
R134  85.5,80.6 0 top
R135  87.35,74.55 270 top
U1  71,92.5 90 top

### Tracks (layer width: path | path; a pad name or v marks a point on that pad's centre or on a via)
3V30  (4 unrouted)
  Top 0.152: 15.4,90.93 14.79,90.32 14.79,89.56 R35.1 | 14.84,89.5 16.04,88.31 16.04,72.31 R47.2 | 5.42,73.78 6.71,72.49 7.93,72.49 9.08,71.34 9.31,71.34 FB3.2 9.38,71.27 10.88,69.77 10.88,68.63 10.9,68.63 11.79,67.74 15.15,67.74 16.16,68.75 16.16,72.35
3V31  (4 unrouted)
  Top 0.152: 2.6,9.07 3.21,9.68 3.21,10.45 R89.1 | 3.16,10.5 1.97,11.69 1.97,27.68 R101.2 | 12.58,26.22 11.29,27.51 10.07,27.51 8.92,28.66 8.69,28.66 FB5.2 8.62,28.73 7.12,30.23 7.12,31.37 7.1,31.37 6.21,32.26 2.85,32.26 1.84,31.25 1.84,27.65
3V32  (4 unrouted)
  Top 0.152: 84.6,9.07 85.21,9.68 85.21,10.45 R62.1 | 85.16,10.5 83.97,11.69 83.97,27.68 R74.2 | 94.58,26.22 93.28,27.51 92.07,27.51 90.92,28.66 90.69,28.66 FB4.2 90.62,28.73 89.12,30.23 89.12,31.37 89.1,31.37 88.22,32.26 84.85,32.26 83.84,31.25 83.84,27.65
3V33  (4 unrouted)
  Top 0.152: 97.4,90.93 96.79,90.32 96.79,89.56 R116.1 | 96.84,89.5 98.03,88.31 98.03,72.31 R128.2 | 87.42,73.78 88.72,72.49 89.93,72.49 91.08,71.34 91.31,71.34 FB6.2 91.38,71.27 92.88,69.77 92.88,68.63 92.9,68.63 93.78,67.74 97.15,67.74 98.16,68.75 98.16,72.35
5V  (1 unrouted)
  Top 0.305: P1.P$40 67.22,97.9 C1.+ 69.81,95.3 71.6,95.3 72.3,94.6 U1.3 74.4,93.45 75,92.85 75,92.05 74.5,91.55 U1.1 | B1.VDD 41.11,40.26 50.6,49.75 50.6,92.65 55.85,97.9 P1.40
GND  (via drill 0.3)
  Top 0.152: C30.1 2.63,75.72 v2.63,76.01 2.63,76.67 C29.1 | R49.1 11.63,70.2 v11.43,70.4 | C28.1 10.2,74.03 v9.69,73.52 | C27.1 12.94,76.06 v12.94,76.42 12.31,77.05 Q13.E | R45.2 8.49,77.84 v8.23,77.84 | R39.2 7.64,81.36 v7.64,81.2 | C25.2 11.32,81.32 v11.11,81.32 | R43.2 14.97,80.98 v14.97,80.41 | C24.2 2.75,82.84 | 2.75,82.84 v2.72,82.81 | R52.2 2.75,82.84 | R37.2 2.75,86.45 v3.2,86.9 | C22.2 11.3,88.25 v11.39,88.34 | v14.15,88.37 14.15,88.3 R41.2 | C21.1 12.08,90.03 v12.18,90.03 | R33.2 2.27,90.82 v1.85,90.82 | C18.1 11.98,97.48 v11.66,97.48 | R31.2 2.12,96.48 v1.61,96.48 | C56.1 15.37,24.28 v15.37,23.99 15.37,23.33 C55.1 | R103.1 6.37,29.8 v6.57,29.6 | C54.1 7.8,25.97 v8.31,26.48 | C53.1 5.06,23.94 v5.06,23.58 5.69,22.95 Q29.E | R99.2 9.51,22.16 v9.77,22.16 | R93.2 10.36,18.64 v10.36,18.8 | C51.2 6.68,18.68 v6.89,18.68 | R97.2 3.03,19.02 v3.03,19.59 | C50.2 15.25,17.16 | 15.25,17.16 v15.28,17.19 | R106.2 15.25,17.16 | R91.2 15.25,13.55 v14.8,13.1 | C48.2 6.7,11.75 v6.61,11.66 | v3.85,11.63 3.85,11.7 R95.2 | C47.1 5.92,9.97 v5.82,9.97 | R87.2 15.73,9.18 v16.15,9.18 | C44.1 6.02,2.52 v6.34,2.52 | R85.2 15.88,3.52 v16.39,3.52 | C43.1 97.37,24.28 v97.37,23.99 97.37,23.33 C42.1 | R76.1 88.37,29.8 v88.57,29.6 | C41.1 89.8,25.97 v90.31,26.48 | C40.1 87.06,23.94 v87.06,23.58 87.69,22.95 Q21.E | R72.2 91.51,22.16 v91.77,22.16 | R66.2 92.36,18.64 v92.36,18.8 | C38.2 88.68,18.68 v88.89,18.68 | R70.2 85.03,19.02 v85.03,19.59 | C37.2 97.25,17.16 | 97.25,17.16 v97.28,17.19 | R79.2 97.25,17.16 | R64.2 97.25,13.55 v96.8,13.1 | C35.2 88.7,11.75 v88.61,11.66 | v85.85,11.63 85.85,11.7 R68.2 | C34.1 87.92,9.97 v87.82,9.97 | R60.2 97.73,9.18 v98.15,9.18 | C31.1 88.02,2.52 v88.34,2.52
  Top 0.152: R58.2 97.88,3.52 v98.39,3.52 | C69.1 84.63,75.72 v84.63,76.01 84.63,76.67 C68.1 | R130.1 93.63,70.2 v93.43,70.4 | C67.1 92.2,74.03 v91.69,73.52 | C66.1 94.94,76.06 v94.94,76.42 94.31,77.05 Q37.E | R126.2 90.49,77.84 v90.23,77.84 | R120.2 89.64,81.36 v89.64,81.2 | C64.2 93.32,81.32 v93.11,81.32 | R124.2 96.97,80.98 v96.97,80.41 | C63.2 84.75,82.84 | 84.75,82.84 v84.72,82.81 | R133.2 84.75,82.84 | R118.2 84.75,86.45 v85.2,86.9 | C61.2 93.3,88.25 v93.39,88.34 | v96.15,88.37 96.15,88.3 R122.2 | C60.1 94.08,90.03 v94.18,90.03 | R114.2 84.27,90.82 v83.85,90.82 | C57.1 93.98,97.48 v93.66,97.48 | R112.2 84.12,96.48 v83.61,96.48 | U1.2 73.04,92.5 v73.06,92.48 | C1.- 71.79,96.61 v72.36,97.18 | C2.2 64.83,93.18 v64.36,93.18 | C4.- 73.31,88.18 v73.36,88.18 | C3.- 73.19,83.68 v73.36,83.68
  other vias: 9.04,94.23 7.38,97.57 10.79,97.52 15.49,98.39 13.56,92.16 1.67,85.02 6.27,71.14 1.87,71 16.19,67.74 10.7,67.67 4.36,92.18 9.04,72.21 13.71,85.22 13.59,82.88 10.25,86.19 15.44,78.9 2.4,72.89 13.98,95.5 11.34,93.85 16.43,90.64 8.96,5.77 10.62,2.43 7.21,2.48 2.51,1.61 4.44,7.84 16.33,14.98 11.73,28.86 16.13,29 1.81,32.26 7.3,32.33 13.64,7.82 8.96,27.79 4.29,14.78 4.41,17.12 7.75,13.81 2.56,21.1 15.6,27.11 4.02,4.5 6.66,6.15 1.57,9.36 90.96,5.77 92.62,2.43 89.21,2.48 84.51,1.61 86.44,7.84 98.33,14.98 93.73,28.86 98.13,29 83.81,32.26 89.3,32.33 95.64,7.82 90.96,27.79 86.29,14.78 86.41,17.12 89.75,13.81 84.56,21.1 97.6,27.11 86.02,4.5 88.66,6.15 83.57,9.36 91.04,94.23 89.38,97.57 92.79,97.52 97.49,98.39 95.56,92.16 83.67,85.02 88.27,71.14 83.87,71 98.19,67.74 92.7,67.67 86.36,92.18 91.04,72.21 95.71,85.22 95.59,82.88 92.25,86.19 97.44,78.9 84.4,72.89 95.98,95.5 93.34,93.85 98.43,90.64 71.49,92.49 70.64,92.69 70.94,91.89 71.14,93.39 71.04,91.14 70.94,94.14 78.94,84.94 81.14,77.34 71.74,76.24 69.84,81.24 64.94,83.04 64.54,76.34 54.64,65.64 80.34,94.94 76.44,58.74 45.74,75.34 52.04,58.94 54.44,53.34 25.34,8.24 64.04,42.84 51.44,48.14 65.64,23.44 55.64,38.24 42.44,44.64 26.14,53.34 7.04,44.04 19.14,37.84 17.24,62.34 3.74,58.84 24.24,79.04 22.24,96.34 36.34,94.74 35.94,84.64 46.54,95.94 55.04,89.04 32.44,21.24 73.54,10.94 82.24,45.94 96.04,48.94 96.04,60.24 95.84,36.74 38.24,28.04 51.04,28.04 78.14,29.54
  pour Bottom: -2,102 102,102 102,-2 -2,-2
  pour Top: -1,101 101,101 101,-1 -1,-1
N$1
  Top 0.305: C2.1 69.65,93.5 U1.4
N$2  (1 unrouted)
  Top 0.305: FB1.1 P1.36
N$23  (2 unrouted)
  Top 0.152: P1.P$29 61.41,69.96 62.7,71.25 62.7,81.55 61.59,82.66 P1.34
N$27
  Top 0.152: R29.2 12.43,93.52 12.89,93.52 15.78,96.41 R28.2 15.71,96.41 14.18,97.94 14.05,97.94 C18.2
N$28
  Top 0.152: C19.1 10.53,92.91 10.53,93.97 12.51,95.96 D2.2 12.58,96.03 12.96,96.41 14.26,96.41 R28.1
N$29
  Top 0.152: 5.65,95.8 5.5,95.96 D2.1 | 5.65,92.98 Q9.B 5.65,93.06 5.65,95.8 | 4.96,96.49 5.42,96.03 D2.1 | 4.35,96.41 4.96,96.41 D2.1 | 4.35,96.41 3.74,96.41 R31.1 | 4.35,96.41 4.35,97.88 R30.2 | 5.65,95.8 D2.1
N$30
  Top 0.152: Q10.E 6.33,89.71 6.33,89.4 5.42,88.49 5.42,87.19 5.5,87.12 7.17,87.12 7.4,87.34 7.4,88.18 8.31,89.1 R32.1 8.39,89.17 9.76,89.17 10.07,89.48 C21.2 10.14,89.56 10.14,89.78 11.13,90.77 11.13,92.07 | 11.13,92.07 12.35,92.07 R29.1 12.43,91.99 13.42,91 13.88,91 R34.1 | 11.13,92.07 9.99,92.07 6.8,95.26 6.8,97 5.9,97.9 5.8,97.9 5.8,97.78 5.72,97.78 R30.1
N$31
  Top 0.152: Q9.C 8.31,91.54 8.31,90.7 R32.2 8.31,90.62 7.63,89.94 7.63,89.48 6.41,88.26 6.41,87.88 Q10.B
N$32
  Top 0.152: 3.55,89.44 4.12,88.87 Q10.C | 3.55,89.44 3.52,89.48 2.6,89.48 C20.1 | 3.55,89.44 3.9,89.78 3.9,90.93 R33.1 3.97,91 5.65,91 Q9.E 5.72,91.08 5.72,91.46 7.02,92.76 8.62,92.76 9.99,91.38 10.45,91.38 C19.2
N$33
  Top 0.152: 8.81,83.73 9.31,84.22 9.31,84.3 9.53,84.53 10.6,84.53 11.13,85.06 11.13,86.05 11.29,86.2 C22.1 | 8.81,83.73 8.77,83.69 8.77,82.32 R42.1 | R36.1 4.28,84.91 7.1,84.91 7.4,84.6 7.4,84.22 7.86,83.76 8.77,83.76 8.81,83.73 | R38.1 9.69,87.57 11.13,86.13 C22.1 | 12.05,87.12 12.05,86.96 11.36,86.28 C22.1 | 12.05,87.12 12.05,87.5 13.19,88.64 13.19,89.48 R35.2 | 12.05,87.12 14.26,87.12 14.72,87.57 15.17,87.57 R40.1
N$34
  Top 0.152: 4.2,86.43 4.2,86.66 2.9,87.95 2.6,87.95 C20.2 | 4.2,86.43 2.75,84.98 R36.2 | 4.2,86.43 R37.1 4.28,86.36 4.81,85.82 6.11,85.82 Q11.B
N$35
  Top 0.152: 8.16,85.29 8.16,84.98 8.31,84.83 Q11.C 8.16,85.29 | 8.16,85.29 8.16,87.57 R38.2 | 8.16,85.29 9.99,85.29 C23.1
N$36
  Top 0.152: 5.72,83.53 5.8,83.53 6.11,83.84 Q11.E 5.72,83.53 | 5.72,83.53 4.28,83.53 C24.1 | 5.72,83.53 5.72,81.86 R39.1
N$37
  Top 0.152: R40.2 15.17,86.13 13.88,86.13 13.72,86.28 R41.1 13.65,86.28 13.42,86.28 12.12,84.98 Q12.B 12.05,84.91 10.91,83.76 10.07,83.76 C23.2
N$38
  Top 0.152: 10.53,82.32 11.06,82.32 11.74,83 12.05,83 Q12.E | 10.53,82.32 10.3,82.32 R42.2 10.53,82.32 | 10.53,82.32 10.53,81.1 11.36,80.26 C25.1
N$39
  Top 0.152: C26.1 13.57,81.78 14.26,81.78 14.95,82.47 R43.1 14.95,82.55 14.34,83.15 14.34,83.99 Q12.C
N$40
  Top 0.152: 10.3,78.96 10.3,79.65 10.22,79.72 R44.2 | 10.3,78.96 10.3,78.2 R45.1 | C26.2 13.5,80.18 12.2,78.89 Q13.B 12.12,78.96 10.3,78.96
N$41
  Top 0.152: Q14.E 13.65,70.89 14.34,71.57 14.34,72.33 R47.1 14.26,72.33 13.95,72.33 12.81,73.48 12.28,73.48 11.74,74.01 C28.2 11.67,74.09 11.67,74.24 10.3,75.61 R48.2 10.22,75.69 9.61,76.3 9.61,78.73 8.77,79.57 8.77,79.72 R44.1
N$42
  Top 0.152: R48.1 11.82,75.61 13.27,74.16 C27.2 13.34,74.24 14.11,75 14.79,75 R46.2 14.79,74.92 15.1,74.62 15.1,71.88 15.33,71.65 15.33,70.88 Q14.B
N$43
  Top 0.152: R46.1 14.79,76.6 14.79,77.59 14.41,77.97 Q13.C
N$44
  Top 0.152: 12.73,68.68 14.34,68.68 14.34,68.67 Q14.C | 12.73,68.68 12.12,68.68 R49.2 | 12.73,68.68 12.73,70.81 12.51,71.04 12.51,72.49 R50.2
N$45
  Top 0.152: R50.1 10.98,72.56 9.84,72.56 8.85,73.55 8.85,75.61 Q15.B
N$46
  Top 0.152: R52.1 4.28,82.09 4.28,81.86 5.5,80.64 5.5,79.57 Q16.E 5.57,79.5 5.57,76.68 6.56,75.69 6.87,75.69 Q15.E
N$47
  Top 0.152: 7.06,74.2 7.78,73.48 Q15.C | 7.06,74.2 6.71,74.54 4.81,74.54 4.12,75.23 4.12,76.68 R51.2 | 7.06,74.2 7.63,74.77 7.63,76.45 7.48,76.6 7.48,79.5 Q16.B
N$48
  Top 0.152: R54.1 5.34,76.45 4.73,77.06 4.73,77.59 4.12,78.2 R51.1 4.05,78.28 2.75,78.28 | 2.75,78.28 2.52,78.28 C29.2 2.75,78.28 | 2.75,78.28 2.75,80.56 R53.1
N$50
  Top 0.152: R56.2 87.57,6.48 87.11,6.48 84.22,3.59 R55.2 84.29,3.59 85.82,2.06 85.95,2.06 C31.2
N$51
  Top 0.152: C32.1 89.47,7.09 89.47,6.03 87.49,4.04 D3.2 87.42,3.97 87.04,3.59 85.74,3.59 R55.1
N$52
  Top 0.152: 94.35,4.2 94.5,4.04 D3.1 | 94.35,7.02 Q17.B 94.35,6.94 94.35,4.2 | 95.04,3.51 94.58,3.97 D3.1 | 95.65,3.59 95.04,3.59 D3.1 | 95.65,3.59 96.26,3.59 R58.1 | 95.65,3.59 95.65,2.12 R57.2 | 94.35,4.2 D3.1
N$53
  Top 0.152: Q18.E 93.67,10.29 93.67,10.6 94.58,11.51 94.58,12.81 94.5,12.88 92.83,12.88 92.6,12.65 92.6,11.82 91.69,10.9 R59.1 91.61,10.83 90.24,10.83 89.93,10.52 C34.2 89.86,10.45 89.86,10.22 88.86,9.23 88.86,7.93 | 88.86,7.93 87.65,7.93 R56.1 87.57,8.01 86.58,9 86.12,9 R61.1 | 88.86,7.93 90.01,7.93 93.2,4.74 93.2,3 94.1,2.1 94.2,2.1 94.2,2.21 94.28,2.22 R57.1
N$54
  Top 0.152: Q17.C 91.69,8.46 91.69,9.3 R59.2 91.69,9.38 92.37,10.06 92.37,10.52 93.59,11.74 93.59,12.12 Q18.B
N$55
  Top 0.152: 96.45,10.56 95.88,11.13 Q18.C | 96.45,10.56 96.48,10.52 97.4,10.52 C33.1 | 96.45,10.56 96.1,10.22 96.1,9.07 R60.1 96.03,9 94.35,9 Q17.E 94.28,8.92 94.28,8.54 92.98,7.24 91.38,7.24 90.01,8.62 89.55,8.62 C32.2
N$56
  Top 0.152: 91.19,16.27 90.69,15.78 90.69,15.7 90.47,15.47 89.4,15.47 88.86,14.94 88.86,13.95 88.71,13.8 C35.1 | 91.19,16.27 91.23,16.31 91.23,17.68 R69.1 | R63.1 95.72,15.09 92.9,15.09 92.6,15.4 92.6,15.78 92.14,16.24 91.23,16.24 91.19,16.27 | R65.1 90.31,12.43 88.86,13.87 C35.1 | 87.95,12.88 87.95,13.04 88.64,13.72 C35.1 | 87.95,12.88 87.95,12.5 86.81,11.36 86.81,10.52 R62.2 | 87.95,12.88 85.74,12.88 85.28,12.43 84.83,12.43 R67.1
N$57
  Top 0.152: 95.8,13.57 95.8,13.34 97.09,12.04 97.4,12.04 C33.2 | 95.8,13.57 97.25,15.02 R63.2 | 95.8,13.57 R64.1 95.72,13.64 95.19,14.18 93.89,14.18 Q19.B
N$58
  Top 0.152: 91.84,14.71 91.84,15.02 91.69,15.17 Q19.C 91.84,14.71 | 91.84,14.71 91.84,12.43 R65.2 | 91.84,14.71 90.01,14.71 C36.1
N$59
  Top 0.152: 94.28,16.46 94.2,16.46 93.89,16.16 Q19.E 94.28,16.46 | 94.28,16.46 95.72,16.46 C37.1 | 94.28,16.46 94.28,18.14 R66.1
N$60
  Top 0.152: R67.2 84.83,13.87 86.12,13.87 86.28,13.72 R68.1 86.35,13.72 86.58,13.72 87.88,15.02 Q20.B 87.95,15.09 89.09,16.24 89.93,16.24 C36.2
N$61
  Top 0.152: 89.47,17.68 88.94,17.68 88.26,17 87.95,17 Q20.E | 89.47,17.68 89.7,17.68 R69.2 89.47,17.68 | 89.47,17.68 89.47,18.9 88.64,19.74 C38.1
N$62
  Top 0.152: C39.1 86.43,18.22 85.74,18.22 85.06,17.53 R70.1 85.06,17.45 85.67,16.85 85.67,16.01 Q20.C
N$63
  Top 0.152: 89.7,21.04 89.7,20.35 89.78,20.27 R71.2 | 89.7,21.04 89.7,21.8 R72.1 | C39.2 86.5,19.82 87.8,21.11 Q21.B 87.88,21.04 89.7,21.04
N$64
  Top 0.152: Q22.E 86.35,29.11 85.67,28.43 85.67,27.67 R74.1 85.74,27.67 86.05,27.67 87.19,26.52 87.72,26.52 88.26,25.99 C41.2 88.33,25.91 88.33,25.76 89.7,24.39 R75.2 89.78,24.31 90.39,23.7 90.39,21.27 91.23,20.43 91.23,20.27 R71.1
N$65
  Top 0.152: R75.1 88.18,24.39 86.73,25.84 C40.2 86.66,25.76 85.89,25 85.21,25 R73.2 85.21,25.07 84.9,25.38 84.9,28.12 84.67,28.35 84.67,29.12 Q22.B
N$66
  Top 0.152: R73.1 85.21,23.4 85.21,22.41 85.59,22.03 Q21.C
N$67
  Top 0.152: 87.27,31.32 85.67,31.32 85.66,31.33 Q22.C | 87.27,31.32 87.88,31.32 R76.2 | 87.27,31.32 87.27,29.19 87.49,28.96 87.49,27.51 R77.2
N$68
  Top 0.152: R77.1 89.02,27.44 90.16,27.44 91.15,26.45 91.15,24.39 Q23.B
N$69
  Top 0.152: R79.1 95.72,17.91 95.72,18.14 94.5,19.36 94.5,20.43 Q24.E 94.43,20.5 94.43,23.32 93.44,24.31 93.13,24.31 Q23.E
N$70
  Top 0.152: 92.94,25.8 92.22,26.52 Q23.C | 92.94,25.8 93.28,25.46 95.19,25.46 95.88,24.77 95.88,23.32 R78.2 | 92.94,25.8 92.37,25.23 92.37,23.55 92.52,23.4 92.52,20.5 Q24.B
N$71
  Top 0.152: R81.1 94.66,23.55 95.27,22.94 95.27,22.41 95.88,21.8 R78.1 95.95,21.72 97.25,21.72 | 97.25,21.72 97.48,21.72 C42.2 97.25,21.72 | 97.25,21.72 97.25,19.44 R80.1
N$73
  Top 0.152: R83.2 5.57,6.48 5.11,6.48 2.22,3.59 R82.2 2.29,3.59 3.82,2.06 3.95,2.06 C44.2
N$74
  Top 0.152: C45.1 7.47,7.09 7.47,6.03 5.49,4.04 D4.2 5.42,3.97 5.04,3.59 3.74,3.59 R82.1
N$75
  Top 0.152: 12.35,4.2 12.5,4.04 D4.1 | 12.35,7.02 Q25.B 12.35,6.94 12.35,4.2 | 13.04,3.51 12.58,3.97 D4.1 | 13.65,3.59 13.04,3.59 D4.1 | 13.65,3.59 14.26,3.59 R85.1 | 13.65,3.59 13.65,2.12 R84.2 | 12.35,4.2 D4.1
N$76
  Top 0.152: Q26.E 11.67,10.29 11.67,10.6 12.58,11.51 12.58,12.81 12.5,12.88 10.83,12.88 10.6,12.65 10.6,11.82 9.69,10.9 R86.1 9.61,10.83 8.24,10.83 7.93,10.52 C47.2 7.86,10.45 7.86,10.22 6.87,9.23 6.87,7.93 | 6.87,7.93 5.65,7.93 R83.1 5.57,8.01 4.58,9 4.12,9 R88.1 | 6.87,7.93 8.01,7.93 11.2,4.74 11.2,3 12.1,2.1 12.2,2.1 12.2,2.21 12.28,2.22 R84.1
N$77
  Top 0.152: Q25.C 9.69,8.46 9.69,9.3 R86.2 9.69,9.38 10.37,10.06 10.37,10.52 11.59,11.74 11.59,12.12 Q26.B
N$78
  Top 0.152: 14.45,10.56 13.88,11.13 Q26.C | 14.45,10.56 14.48,10.52 15.4,10.52 C46.1 | 14.45,10.56 14.1,10.22 14.1,9.07 R87.1 14.03,9 12.35,9 Q25.E 12.28,8.92 12.28,8.54 10.98,7.24 9.38,7.24 8.01,8.62 7.55,8.62 C45.2
N$79
  Top 0.152: 9.19,16.27 8.69,15.78 8.69,15.7 8.47,15.47 7.4,15.47 6.87,14.94 6.87,13.95 6.71,13.8 C48.1 | 9.19,16.27 9.23,16.31 9.23,17.68 R96.1 | R90.1 13.72,15.09 10.9,15.09 10.6,15.4 10.6,15.78 10.14,16.24 9.23,16.24 9.19,16.27 | R92.1 8.31,12.43 6.87,13.87 C48.1 | 5.95,12.88 5.95,13.04 6.64,13.72 C48.1 | 5.95,12.88 5.95,12.5 4.81,11.36 4.81,10.52 R89.2 | 5.95,12.88 3.74,12.88 3.28,12.43 2.83,12.43 R94.1
N$80
  Top 0.152: 13.8,13.57 13.8,13.34 15.1,12.04 15.4,12.04 C46.2 | 13.8,13.57 15.25,15.02 R90.2 | 13.8,13.57 R91.1 13.72,13.64 13.19,14.18 11.89,14.18 Q27.B
N$81
  Top 0.152: 9.84,14.71 9.84,15.02 9.69,15.17 Q27.C 9.84,14.71 | 9.84,14.71 9.84,12.43 R92.2 | 9.84,14.71 8.01,14.71 C49.1
N$82
  Top 0.152: 12.28,16.46 12.2,16.46 11.89,16.16 Q27.E 12.28,16.46 | 12.28,16.46 13.72,16.46 C50.1 | 12.28,16.46 12.28,18.14 R93.1
N$83
  Top 0.152: R94.2 2.83,13.87 4.12,13.87 4.28,13.72 R95.1 4.35,13.72 4.58,13.72 5.88,15.02 Q28.B 5.95,15.09 7.09,16.24 7.93,16.24 C49.2
N$84
  Top 0.152: 7.47,17.68 6.94,17.68 6.26,17 5.95,17 Q28.E | 7.47,17.68 7.7,17.68 R96.2 7.47,17.68 | 7.47,17.68 7.47,18.9 6.64,19.74 C51.1
N$85
  Top 0.152: C52.1 4.43,18.22 3.74,18.22 3.06,17.53 R97.1 3.06,17.45 3.67,16.85 3.67,16.01 Q28.C
N$86
  Top 0.152: 7.7,21.04 7.7,20.35 7.78,20.27 R98.2 | 7.7,21.04 7.7,21.8 R99.1 | C52.2 4.5,19.82 5.8,21.11 Q29.B 5.88,21.04 7.7,21.04
N$87
  Top 0.152: Q30.E 4.35,29.11 3.67,28.43 3.67,27.67 R101.1 3.74,27.67 4.05,27.67 5.19,26.52 5.72,26.52 6.26,25.99 C54.2 6.33,25.91 6.33,25.76 7.7,24.39 R102.2 7.78,24.31 8.39,23.7 8.39,21.27 9.23,20.43 9.23,20.27 R98.1
N$88
  Top 0.152: R102.1 6.18,24.39 4.73,25.84 C53.2 4.66,25.76 3.89,25 3.21,25 R100.2 3.21,25.07 2.9,25.38 2.9,28.12 2.67,28.35 2.67,29.12 Q30.B
N$89
  Top 0.152: R100.1 3.21,23.4 3.21,22.41 3.59,22.03 Q29.C
N$90
  Top 0.152: 5.26,31.32 3.67,31.32 3.66,31.33 Q30.C | 5.26,31.32 5.88,31.32 R103.2 | 5.26,31.32 5.26,29.19 5.49,28.96 5.49,27.51 R104.2
N$91
  Top 0.152: R104.1 7.02,27.44 8.16,27.44 9.15,26.45 9.15,24.39 Q31.B
N$92
  Top 0.152: R106.1 13.72,17.91 13.72,18.14 12.5,19.36 12.5,20.43 Q32.E 12.43,20.5 12.43,23.32 11.44,24.31 11.13,24.31 Q31.E
N$93
  Top 0.152: 10.94,25.8 10.22,26.52 Q31.C | 10.94,25.8 11.29,25.46 13.19,25.46 13.88,24.77 13.88,23.32 R105.2 | 10.94,25.8 10.37,25.23 10.37,23.55 10.52,23.4 10.52,20.5 Q32.B
N$94
  Top 0.152: R108.1 12.66,23.55 13.27,22.94 13.27,22.41 13.88,21.8 R105.1 13.95,21.72 15.25,21.72 | 15.25,21.72 15.48,21.72 C55.2 15.25,21.72 | 15.25,21.72 15.25,19.44 R107.1
N$96
  Top 0.152: R110.2 94.43,93.52 94.89,93.52 97.78,96.41 R109.2 97.71,96.41 96.18,97.94 96.05,97.94 C57.2
N$97
  Top 0.152: C58.1 92.53,92.91 92.53,93.97 94.51,95.96 D5.2 94.58,96.03 94.96,96.41 96.26,96.41 R109.1
N$98
  Top 0.152: 87.65,95.8 87.5,95.96 D5.1 | 87.65,92.98 Q33.B 87.65,93.06 87.65,95.8 | 86.96,96.49 87.42,96.03 D5.1 | 86.35,96.41 86.96,96.41 D5.1 | 86.35,96.41 85.74,96.41 R112.1 | 86.35,96.41 86.35,97.88 R111.2 | 87.65,95.8 D5.1
N$99
  Top 0.152: Q34.E 88.33,89.71 88.33,89.4 87.42,88.49 87.42,87.19 87.5,87.12 89.17,87.12 89.4,87.34 89.4,88.18 90.31,89.1 R113.1 90.39,89.17 91.76,89.17 92.07,89.48 C60.2 92.14,89.56 92.14,89.78 93.14,90.77 93.14,92.07 | 93.14,92.07 94.35,92.07 R110.1 94.43,91.99 95.42,91 95.88,91 R115.1 | 93.14,92.07 91.99,92.07 88.8,95.26 88.8,97 87.9,97.9 87.8,97.9 87.8,97.78 87.72,97.78 R111.1
N$100
  Top 0.152: Q33.C 90.31,91.54 90.31,90.7 R113.2 90.31,90.62 89.63,89.94 89.63,89.48 88.41,88.26 88.41,87.88 Q34.B
N$101
  Top 0.152: 85.55,89.44 86.12,88.87 Q34.C | 85.55,89.44 85.52,89.48 84.6,89.48 C59.1 | 85.55,89.44 85.9,89.78 85.9,90.93 R114.1 85.97,91 87.65,91 Q33.E 87.72,91.08 87.72,91.46 89.02,92.76 90.62,92.76 91.99,91.38 92.45,91.38 C58.2
N$102
  Top 0.152: 90.81,83.73 91.31,84.22 91.31,84.3 91.53,84.53 92.6,84.53 93.14,85.06 93.14,86.05 93.29,86.2 C61.1 | 90.81,83.73 90.77,83.69 90.77,82.32 R123.1 | R117.1 86.28,84.91 89.1,84.91 89.4,84.6 89.4,84.22 89.86,83.76 90.77,83.76 90.81,83.73 | R119.1 91.69,87.57 93.14,86.13 C61.1 | 94.05,87.12 94.05,86.96 93.36,86.28 C61.1 | 94.05,87.12 94.05,87.5 95.19,88.64 95.19,89.48 R116.2 | 94.05,87.12 96.26,87.12 96.72,87.57 97.17,87.57 R121.1
N$103
  Top 0.152: 86.2,86.43 86.2,86.66 84.91,87.95 84.6,87.95 C59.2 | 86.2,86.43 84.75,84.98 R117.2 | 86.2,86.43 R118.1 86.28,86.36 86.81,85.82 88.11,85.82 Q35.B
N$104
  Top 0.152: 90.16,85.29 90.16,84.98 90.31,84.83 Q35.C 90.16,85.29 | 90.16,85.29 90.16,87.57 R119.2 | 90.16,85.29 91.99,85.29 C62.1
N$105
  Top 0.152: 87.72,83.53 87.8,83.53 88.11,83.84 Q35.E 87.72,83.53 | 87.72,83.53 86.28,83.53 C63.1 | 87.72,83.53 87.72,81.86 R120.1
N$106
  Top 0.152: R121.2 97.17,86.13 95.88,86.13 95.72,86.28 R122.1 95.65,86.28 95.42,86.28 94.12,84.98 Q36.B 94.05,84.91 92.91,83.76 92.07,83.76 C62.2
N$107
  Top 0.152: 92.53,82.32 93.06,82.32 93.74,83 94.05,83 Q36.E | 92.53,82.32 92.3,82.32 R123.2 92.53,82.32 | 92.53,82.32 92.53,81.1 93.36,80.26 C64.1
N$108
  Top 0.152: C65.1 95.57,81.78 96.26,81.78 96.94,82.47 R124.1 96.94,82.55 96.33,83.15 96.33,83.99 Q36.C
N$109
  Top 0.152: 92.3,78.96 92.3,79.65 92.22,79.72 R125.2 | 92.3,78.96 92.3,78.2 R126.1 | C65.2 95.5,80.18 94.2,78.89 Q37.B 94.12,78.96 92.3,78.96
N$110
  Top 0.152: Q38.E 95.65,70.89 96.33,71.57 96.33,72.33 R128.1 96.26,72.33 95.95,72.33 94.81,73.48 94.28,73.48 93.74,74.01 C67.2 93.67,74.09 93.67,74.24 92.3,75.61 R129.2 92.22,75.69 91.61,76.3 91.61,78.73 90.77,79.57 90.77,79.72 R125.1
N$111
  Top 0.152: R129.1 93.82,75.61 95.27,74.16 C66.2 95.34,74.24 96.11,75 96.79,75 R127.2 96.79,74.92 97.1,74.62 97.1,71.88 97.33,71.65 97.33,70.88 Q38.B
N$112
  Top 0.152: R127.1 96.79,76.6 96.79,77.59 96.41,77.97 Q37.C
N$113
  Top 0.152: 94.73,68.68 96.33,68.68 96.34,68.67 Q38.C | 94.73,68.68 94.12,68.68 R130.2 | 94.73,68.68 94.73,70.81 94.51,71.04 94.51,72.49 R131.2
N$114
  Top 0.152: R131.1 92.98,72.56 91.84,72.56 90.85,73.55 90.85,75.61 Q39.B
N$115
  Top 0.152: R133.1 86.28,82.09 86.28,81.86 87.5,80.64 87.5,79.57 Q40.E 87.57,79.5 87.57,76.68 88.56,75.69 88.87,75.69 Q39.E
N$116
  Top 0.152: 89.06,74.2 89.78,73.48 Q39.C | 89.06,74.2 88.72,74.54 86.81,74.54 86.12,75.23 86.12,76.68 R132.2 | 89.06,74.2 89.63,74.77 89.63,76.45 89.48,76.6 89.48,79.5 Q40.B
N$117
  Top 0.152: R135.1 87.34,76.45 86.73,77.06 86.73,77.59 86.12,78.2 R132.1 86.05,78.28 84.75,78.28 | 84.75,78.28 84.52,78.28 C68.2 84.75,78.28 | 84.75,78.28 84.75,80.56 R134.1
S0  (via drill 0.3)  (1 unrouted)
  Top 0.152: Q16.C 6.5,82.68 7.08,83.25 7.08,84.44 6.95,84.58 5.36,84.58 4.96,84.18 3.71,84.18 3.57,84.05 3.57,81.56 4.25,80.88 R53.2 v4.25,79.8
  Bottom 0.152: v4.25,79.8 10.11,85.66 10.47,85.66 17.16,92.35 31.8,92.35 37.35,97.9 P1.1
S1  (via drill 0.3)  (1 unrouted)
  Top 0.152: Q32.C 11.5,17.32 10.92,16.75 10.92,15.55 11.05,15.42 12.64,15.42 13.04,15.82 14.29,15.82 14.43,15.96 14.43,18.45 13.75,19.12 R107.2 v13.75,20.15
  Bottom 0.152: v13.75,20.15 34.05,40.45 34.05,90.55 38.86,95.36 P1.2
S2  (via drill 0.3)  (1 unrouted)
  Top 0.152: Q24.C 93.5,17.32 92.92,16.75 92.92,15.55 93.06,15.42 94.64,15.42 95.05,15.82 96.3,15.82 96.43,15.96 96.43,18.45 95.75,19.12 R80.2 95.75,20.15 v95.8,20.2
  Bottom 0.152: v95.8,20.2 84.27,31.73 83.59,31.73 59.04,56.28 58.51,56.28 57.93,56.85 57.93,57.08 40.95,74.06 40.73,74.06 38.85,75.94 38.85,88.4 40.73,90.28 P1.4
S3  (via drill 0.3)  (1 unrouted)
  Top 0.152: Q40.C 88.5,82.68 89.08,83.25 89.08,84.44 88.94,84.58 87.36,84.58 86.95,84.18 85.7,84.18 85.57,84.05 85.57,81.56 86.25,80.88 R134.2 86.25,79.95 v86.2,79.9
  Bottom 0.152: v86.2,79.9 60.07,79.9 59.31,79.14 49.73,79.14 P1.5
SCL  (1 unrouted)
  Top 0.152: B1.SDA 47.77,33.15 46.65,32.03 45.73,32.03 45.07,32.69 45.07,39.47 53.35,47.75 53.35,73.45 57.48,77.58 P1.32
SDA  (1 unrouted)
  Top 0.152: B1.SCL 46.19,35.24 55.7,44.75 55.7,71.83 P1.31
VDD
  Top 0.152: C30.2 3.13,73.71 3.13,72.94 5.65,72.94 7.25,71.34 7.78,71.34 FB3.1 | C56.2 14.87,26.29 14.87,27.06 12.35,27.06 10.75,28.66 10.22,28.66 FB5.1 | C43.2 96.87,26.29 96.87,27.06 94.35,27.06 92.75,28.66 92.22,28.66 FB4.1 | 85.13,73.71 C69.2 | 89.78,71.34 FB6.1
  Top 0.305: U1.5 69.7,87.33 C4.+ | C4.+ 67,87.25 FB1.2 | C3.+ C4.+ | C3.+ 80.42,73.71 85.13,73.71 | FB4.1 92.15,64.6 89.84,66.91 FB6.1 | FB6.1 88.97,71.3 88.52,71.75 87.1,71.75 C69.2 | C56.2 15.15,26.5 42.8,26.5 | C3.+ 66.4,81.28 66.4,35.4 57.5,26.5 42.8,26.5 | FB3.1 7.85,61.45 41.8,27.5 42.8,26.5
VSYS  (1 unrouted)

### Text on the board
tNames: + | + | + | + | + | + | +